# Altium schematic sheet Power.SchDoc
size A4; SheetNumber: 4; SheetTotal: 4
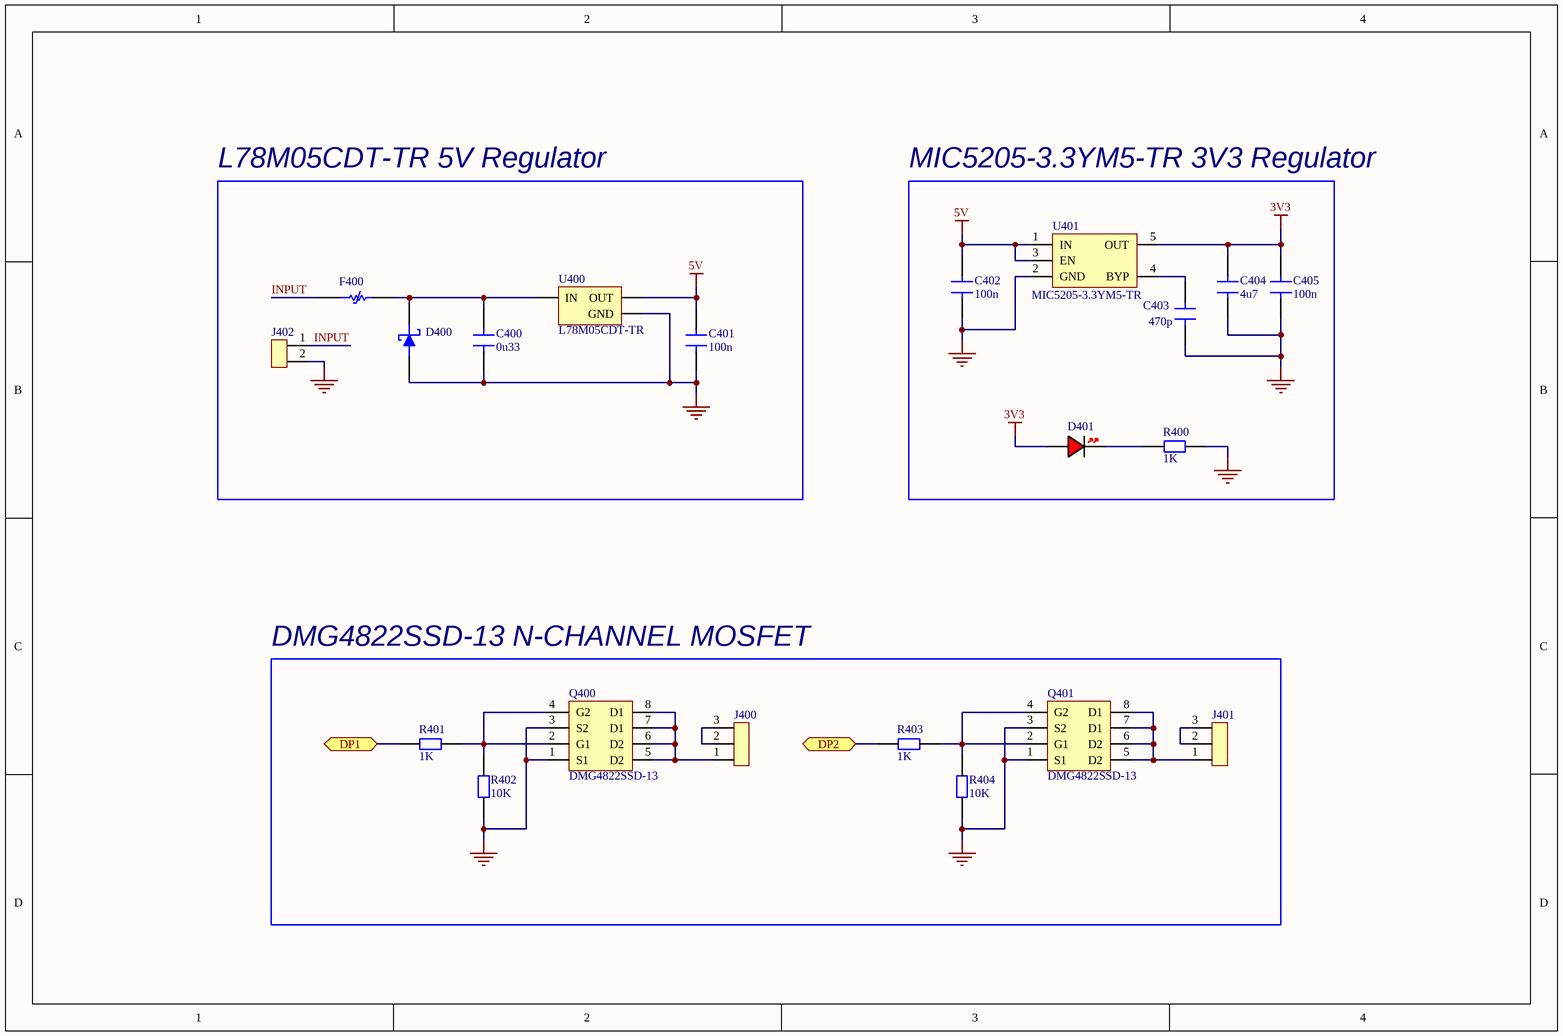
[diagram p0: Power.SchDoc]

## Parts
C400  0u33  [CAP 0805]
C401  100n  [CAP 0805]
C402  100n  [CAP 0805]
C403  470p  [CAP 0805]
C404  4u7  [CAP 0805]
C405  100n  [CAP 0805]
D400  SMBJ12CA-13-F  [SMBJ12CA-13-F]  (value not drawn)
D401  LED 0805 RED  [LED 0805 RED]  (value not drawn)
F400  0ZCG0075FF2C  [0ZCG0075FF2C]  (value not drawn)
J400  KF301 3P Terminal  [KF301 3P]  (value not drawn)
J401  KF301 3P Terminal  [KF301 3P]  (value not drawn)
J402  KF301 2P Terminal  [KF301 2P]  (value not drawn)
Q400  DMG4822SSD-13  [DMG4822SSD-13]
Q401  DMG4822SSD-13  [DMG4822SSD-13]
R400  1K  [RES 0603]
R401  1K  [RES 0603]
R402  10K  [RES 0603]
R403  1K  [RES 0603]
R404  10K  [RES 0603]
U400  L78M05CDT-TR  [L78M05CDT-TR]
U401  MIC5205-3.3YM5-TR  [MIC5205-3.3YM5-TR]

## Blocks framed on the sheet
L78M05CDT-TR 5V Regulator: C400 C401 D400 F400 J402 U400
MIC5205-3.3YM5-TR 3V3 Regulator: C402-C405 D401 R400 U401
DMG4822SSD-13 N-CHANNEL MOSFET: J400 J401 Q400 Q401 R401-R404

## Ports
DP1 (bidir, see MCU[5D]), DP2 (bidir, see MCU[7D])

## Nets
3V3: C404.2 C405.2 D401.A U401.5(OUT)
5V: C401.2 C402.2 U400.3(OUT) U401.1(IN) U401.3(EN)
GND: C400.1 C401.1 C402.1 C403.1 C404.1 C405.1 D400.1 J402.2 Q400.1(S1) Q400.3(S2) Q401.1(S1) Q401.3(S2) R400.2 R402.1 R404.1 U400.2(GND) U401.2(GND)
DP1: R401.1 ; port DP1
DP2: R403.1 ; port DP2
INPUT: F400.1 J402.1
NetC400_2: C400.2 D400.2 F400.2 U400.1(IN)
NetC403_2: C403.2 U401.4(BYP)
NetD401_K: D401.K R400.1
NetJ400_1: J400.1 Q400.5(D2) Q400.6(D2) Q400.7(D1) Q400.8(D1)
NetJ400_2: J400.2 J400.3
NetJ401_1: J401.1 Q401.5(D2) Q401.6(D2) Q401.7(D1) Q401.8(D1)
NetJ401_2: J401.2 J401.3
NetQ400_2: Q400.2(G1) Q400.4(G2) R401.2 R402.2
NetQ401_2: Q401.2(G1) Q401.4(G2) R403.2 R404.2

## Library data of the parts
C400-C405 = CAP 0805 50V: Capacitor SMD 0805 50V
D400 = SMBJ12CA-13-F: TVS DIODE 12VWM 19.9VC SMB; Manufacturer: Diodes; Package Body Material: Plastic; Diode Element Material: SILICON; Voltage Rating (DC): 12V; Direction: Bidirectional; Reverse Breakdown Voltage: 13.3V; Number of Elements: 1; Max Power Dissipation: 600W; Max Surge Current: 30.2A; Breakdown Voltage: 15.3V; Clamping Voltage: 19.9V; Max Reverse Leakage Current: 5uA; Test Current: 1mA; Capacitance: 340pF; Diode Type: ZENER; Time @ Peak Reflow Temperature-Max (s): 5s; Power Line Protection: No; Supplier 1: Future Electronics; Manufacturer Part Number: SMBJ12CA-13-F; RoHS: Yes; Category: TVS Diodes; Stock 1: 27000; Pricing 1: 3000=0,104, 9000=0,0995, 12000=0,0985, 30000=0,0953, 45000=0,0922 (USD); Mount: Surface Mount; Case/Package: SMB; Number of Pins: 2; Terminal Finish: Tin; Package Shape: Rectangular; Min Operating Temperature: -55°C; Max Operating Temperature: 150°C; Package Quantity: 3000; Packaging: Tape and Reel; Series: SMBJ; Reverse Standoff Voltage: 12V; Polarity: Bidirectional; Peak Pulse Power: 600W; Termination: SMD/SMT; Min Breakdown Voltage: 13.3V; Peak Pulse Current: 30.2A; Max Breakdown Voltage: 15.3V; Power Dissipation: 600W; Leakage Current: 5uA; Working Voltage: 12V; Max Output Current: 30.2A; Moisture Sensitivity Level: 1; JESD-30 Code: R-PDSO-C2; Surface Mount: Yes; Terminal Position: DUAL; Technology: AVALANCHE; Peak Reflow Temperature (Cel): 245°C; Terminal Form: C BEND; Clamping Voltage-Max: 19.9V; Number of Bidirectional Channels: 1; Length: 4.57mm; Width: 3.9mm; Height: 2.62mm; Radiation Hardening: No; Lead Free: Contains Lead; RoHS Compliant: Yes; ComponentLink1URL: https://datasheet.ciiva.com/34302/1542303-34302437.pdf?src-supplier=Jameco; ComponentLink1Description: https://datasheet.ciiva.com/34302/1542303-34302437.pdf?src-supplier=Jameco
D401 = LED 0805 RED: LED 0805 RED SMD
F400 = 0ZCG0075FF2C: PTC Resettable Fuse 0.75A(hold) 1.5A(trip) 16VDC 100A 0.8W 0.2s 0.11Ohm SMD Solder Pad 1812 4.73 X 3.41 X 0.65mm T/R...; Manufacturer: Bel; Hold Current: 750mA; Time to Trip: 200ms; Supplier 1: Arrow Electronics; Manufacturer Part Number: 0ZCG0075FF2C; RoHS: Yes; Category: PTC Resettable Fuses; Stock 1: 4661; Pricing 1: 2000=0,0751, 4000=0,0699, 6000=0,065, 10000=0,0604 (USD); Mount: Surface Mount; Case/Package: 1812; Case Code (Metric): 4532; Case Code (Imperial): 1812; Contact Plating: Tin,Matte; Min Operating Temperature: -40°C; Max Operating Temperature: 85°C; Packaging: Cut Tape; Max Current Rating: 100A; Trip Current: 1.5A; Series: 0ZCG; Lead Free: Lead Free; RoHS Compliant: Yes; ComponentLink1URL: https://datasheet.ciiva.com/18550/0zcg-18550523.pdf?src-supplier=Digi-Key; ComponentLink1Description: https://datasheet.ciiva.com/18550/0zcg-18550523.pdf?src-supplier=Digi-Key; ComponentLink2URL: https://datasheet.ciiva.com/18550/0zcg-18550524.pdf?src-supplier=Digi-Key; ComponentLink2Description: https://datasheet.ciiva.com/18550/0zcg-18550524.pdf?src-supplier=Digi-Key; ComponentLink3URL: https://datasheet.ciiva.com/18550/0zcg-18550767.pdf?src-supplier=Digi-Key; ComponentLink3Description: https://datasheet.ciiva.com/18550/0zcg-18550767.pdf?src-supplier=Digi-Key
J400 J401 = KF301 3P Terminal: 3 Pin Screw Terminal Block 5mm
J402 = KF301 2P Terminal: 2 Pin Screw Terminal Block 5mm
Q400 Q401 = DMG4822SSD-13: Dual N-Channel 30 V 1.42 W 10.5 nC Enhancement Mode Mosfet - SOIC-8; Manufacturer: Diodes; Rds On Max: 20mR; Input Capacitance: 478.9pF; Rise Time: 7.9ns; Drain to Source Voltage (Vdss): 30V; Continuous Drain Current (ID): 10A; Max Power Dissipation: 1.42W; Fall Time: 3.1ns; Turn-Off Delay Time: 14.6ns; Turn-On Delay Time: 2.9ns; Gate to Source Voltage (Vgs): 25V; Number of Channels: 2; FET Type: 2 N-Channel; Supplier 1: Arrow Electronics; Manufacturer Part Number: DMG4822SSD-13; RoHS: Yes; Category: MOSFETs; Stock 1: 2374; Pricing 1: 1=0,5556, 10=0,4998, 25=0,4948, 100=0,3987, 250=0,3947, 500=0,3232, 1000=0,265 (USD); Mount: Surface Mount; Case/Package: SOIC; Number of Pins: 8; Weight: 0.00261oz; Min Operating Temperature: -55°C; Max Operating Temperature: 150°C; Package Quantity: 2500; Packaging: Tape and Reel; Drain to Source Resistance: 20mR; Polarity: N-CHANNEL; Series: -; Length: 4.95mm; Width: 3.95mm; Height: 1.5mm; Radiation Hardening: No; Lead Free: Lead Free; Reach SVHC Compliant: Yes; RoHS Compliant: Yes; ComponentLink1URL: https://datasheet.ciiva.com/4443/dmg4822ssd-10758-4443079.pdf?src-supplier=Mouser; ComponentLink1Description: https://datasheet.ciiva.com/4443/dmg4822ssd-10758-4443079.pdf?src-supplier=Mouser; ComponentLink2URL: https://datasheet.ciiva.com/6386/dmg4822ssd-6386688.pdf?src-supplier=Digi-Key; ComponentLink2Description: https://datasheet.ciiva.com/6386/dmg4822ssd-6386688.pdf?src-supplier=Digi-Key; ComponentLink3URL: https://datasheet.ciiva.com/11174/dmg4822ssd-11174891.pdf?src-supplier=Avnet; ComponentLink3Description: https://datasheet.ciiva.com/11174/dmg4822ssd-11174891.pdf?src-supplier=Avnet
R400-R404 = RES 0603: Resistor SMD 0603
U400 = L78M05CDT-TR: IC REG LDO 5V 0.5A DPAK; Manufacturer: STMicroelectronics; Number of Outputs: 1; Max Input Voltage: 35V; Max Output Current: 500mA; Polarity: Positive; Quiescent Current: 6mA; Output Type: Fixed; Min Input Voltage: 7V; Dropout Voltage: 2V; Tolerance: 5%; Power Supply Rejection Ratio (PSRR): 62dB; Supplier 1: Mouser; Manufacturer Part Number: L78M05CDT-TR; RoHS: Yes; Category: Voltage Regulators - Linear; Stock 1: 74380; Pricing 1: 1=0,72, 10=0,629, 50=0,629, 100=0,482, 1000=0,305, 10000=0,277 (USD); Mount: Surface Mount; Case/Package: TO-252; Number of Pins: 3; Min Operating Temperature: 0°C; Max Operating Temperature: 150°C; Output Voltage: 5V; Packaging: Tape and Reel; Package Quantity: 2500; Output Current: 500mA; Nominal Output Voltage: 5V; Number of Regulators: 1; Min Output Voltage: 5V; Max Output Voltage: 5V; Series: -; Output Configuration: Positive; Length: 6.6mm; Width: 6.2mm; Height: 2.4mm; Radiation Hardening: No; RoHS Compliant: Yes; Reach SVHC Compliant: No; Lead Free: Lead Free; ComponentLink1URL: https://datasheet.ciiva.com/34303/2021024-34303902.pdf?src-supplier=Jameco; ComponentLink1Description: https://datasheet.ciiva.com/34303/2021024-34303902.pdf?src-supplier=Jameco; ComponentLink2URL: https://datasheet.ciiva.com/4882/cd00000447-93067-4882369.pdf?src-supplier=Mouser; ComponentLink2Description: https://datasheet.ciiva.com/4882/cd00000447-93067-4882369.pdf?src-supplier=Mouser; ComponentLink3URL: https://datasheet.ciiva.com/15111/getdatasheetpartid-111001-15111751.pdf?src-supplier=Verical; ComponentLink3Description: https://datasheet.ciiva.com/15111/getdatasheetpartid-111001-15111751.pdf?src-supplier=Verical; ComponentLink4URL: https://datasheet.ciiva.com/1512/1834365-1512349.pdf?src-supplier=Element14; ComponentLink4Description: https://datasheet.ciiva.com/1512/1834365-1512349.pdf?src-supplier=Element14; ComponentLink5URL: https://datasheet.ciiva.com/14111/tbl78mxxc-data-e-14111354.pdf?src-supplier=Distrelec; ComponentLink5Description: https://datasheet.ciiva.com/14111/tbl78mxxc-data-e-14111354.pdf?src-supplier=Distrelec; ComponentLink6URL: https://datasheet.ciiva.com/46425/1834365-46425535.pdf?src-supplier=Element14; ComponentLink6Description: https://datasheet.ciiva.com/46425/1834365-46425535.pdf?src-supplier=Element14; ComponentLink7URL: https://datasheet.ciiva.com/2041/cd00000447-2041991.pdf?src-supplier=Digi-Key; ComponentLink7Description: https://datasheet.ciiva.com/2041/cd00000447-2041991.pdf?src-supplier=Digi-Key; ComponentLink8URL: https://datasheet.ciiva.com/2041/cd00000447-2041990.pdf?src-supplier=Digi-Key; ComponentLink8Description: https://datasheet.ciiva.com/2041/cd00000447-2041990.pdf?src-supplier=Digi-Key; ComponentLink9URL: https://datasheet.ciiva.com/2041/cd00000447-2041992.pdf?src-supplier=Digi-Key; ComponentLink9Description: https://datasheet.ciiva.com/2041/cd00000447-2041992.pdf?src-supplier=Digi-Key; ComponentLink10URL: https://datasheet.ciiva.com/16443/cd00000447-16443381.pdf?src-supplier=Future+Electronics; ComponentLink10Description: https://datasheet.ciiva.com/16443/cd00000447-16443381.pdf?src-supplier=Future+Electronics; ComponentLink11URL: https://datasheet.ciiva.com/41439/001184659-da-01-en-ic-reg-ldo-5v-l78m05cdt-tr-to-252-3-stm-41439772.pdf?src-supplier=Conrad; ComponentLink11Description: https://datasheet.ciiva.com/41439/001184659-da-01-en-ic-reg-ldo-5v-l78m05cdt-tr-to-252-3-stm-41439772.pdf?src-supplier=Conrad
U401 = MIC5205-3.3YM5-TR: Linear Voltage Regulator IC Positive Fixed 1 Output 3.3V 150mA SOT-23-5; Manufacturer: Microchip; Dropout Voltage: 165mV; Number of Regulators: 1; Min Input Voltage: 2.5V; Max Input Voltage: 16V; Power Supply Rejection Ratio (PSRR): 75dB; Accuracy: 1%; Supplier 1: Arrow Electronics; Manufacturer Part Number: MIC5205-3.3YM5-TR; RoHS: Yes; Category: Voltage Regulators - Linear; Stock 1: 2538; Pricing 1: 1=0,5386, 10=0,5334, 25=0,4417, 50=0,4373, 100=0,395, 250=0,3909, 500=0,3869, 1000=0,3827, 3000=0,3677 (USD); Mount: Surface Mount; Case/Package: SOT-23; Number of Pins: 5; Min Operating Temperature: -40°C; Max Operating Temperature: 125°C; Packaging: Tape and Reel; Output Voltage: 3.3V; Output Current: 150mA; Nominal Output Voltage: 3.3V; Number of Outputs: 1; Output Type: Fixed; Polarity: Positive; Series: -; Max Output Current: 150mA; Output Voltage Accuracy: 1%; Max Output Voltage: 3.3V; Max Supply Voltage: 16V; Min Supply Voltage: 2.5V; Termination: SMD/SMT; Length: 2.9mm; Width: 1.6mm; Height: 1.1mm; Radiation Hardening: No; Reach SVHC Compliant: No; Lead Free: Lead Free; RoHS Compliant: Yes